# EAGLE design shield (EAGLE 9.6.2)
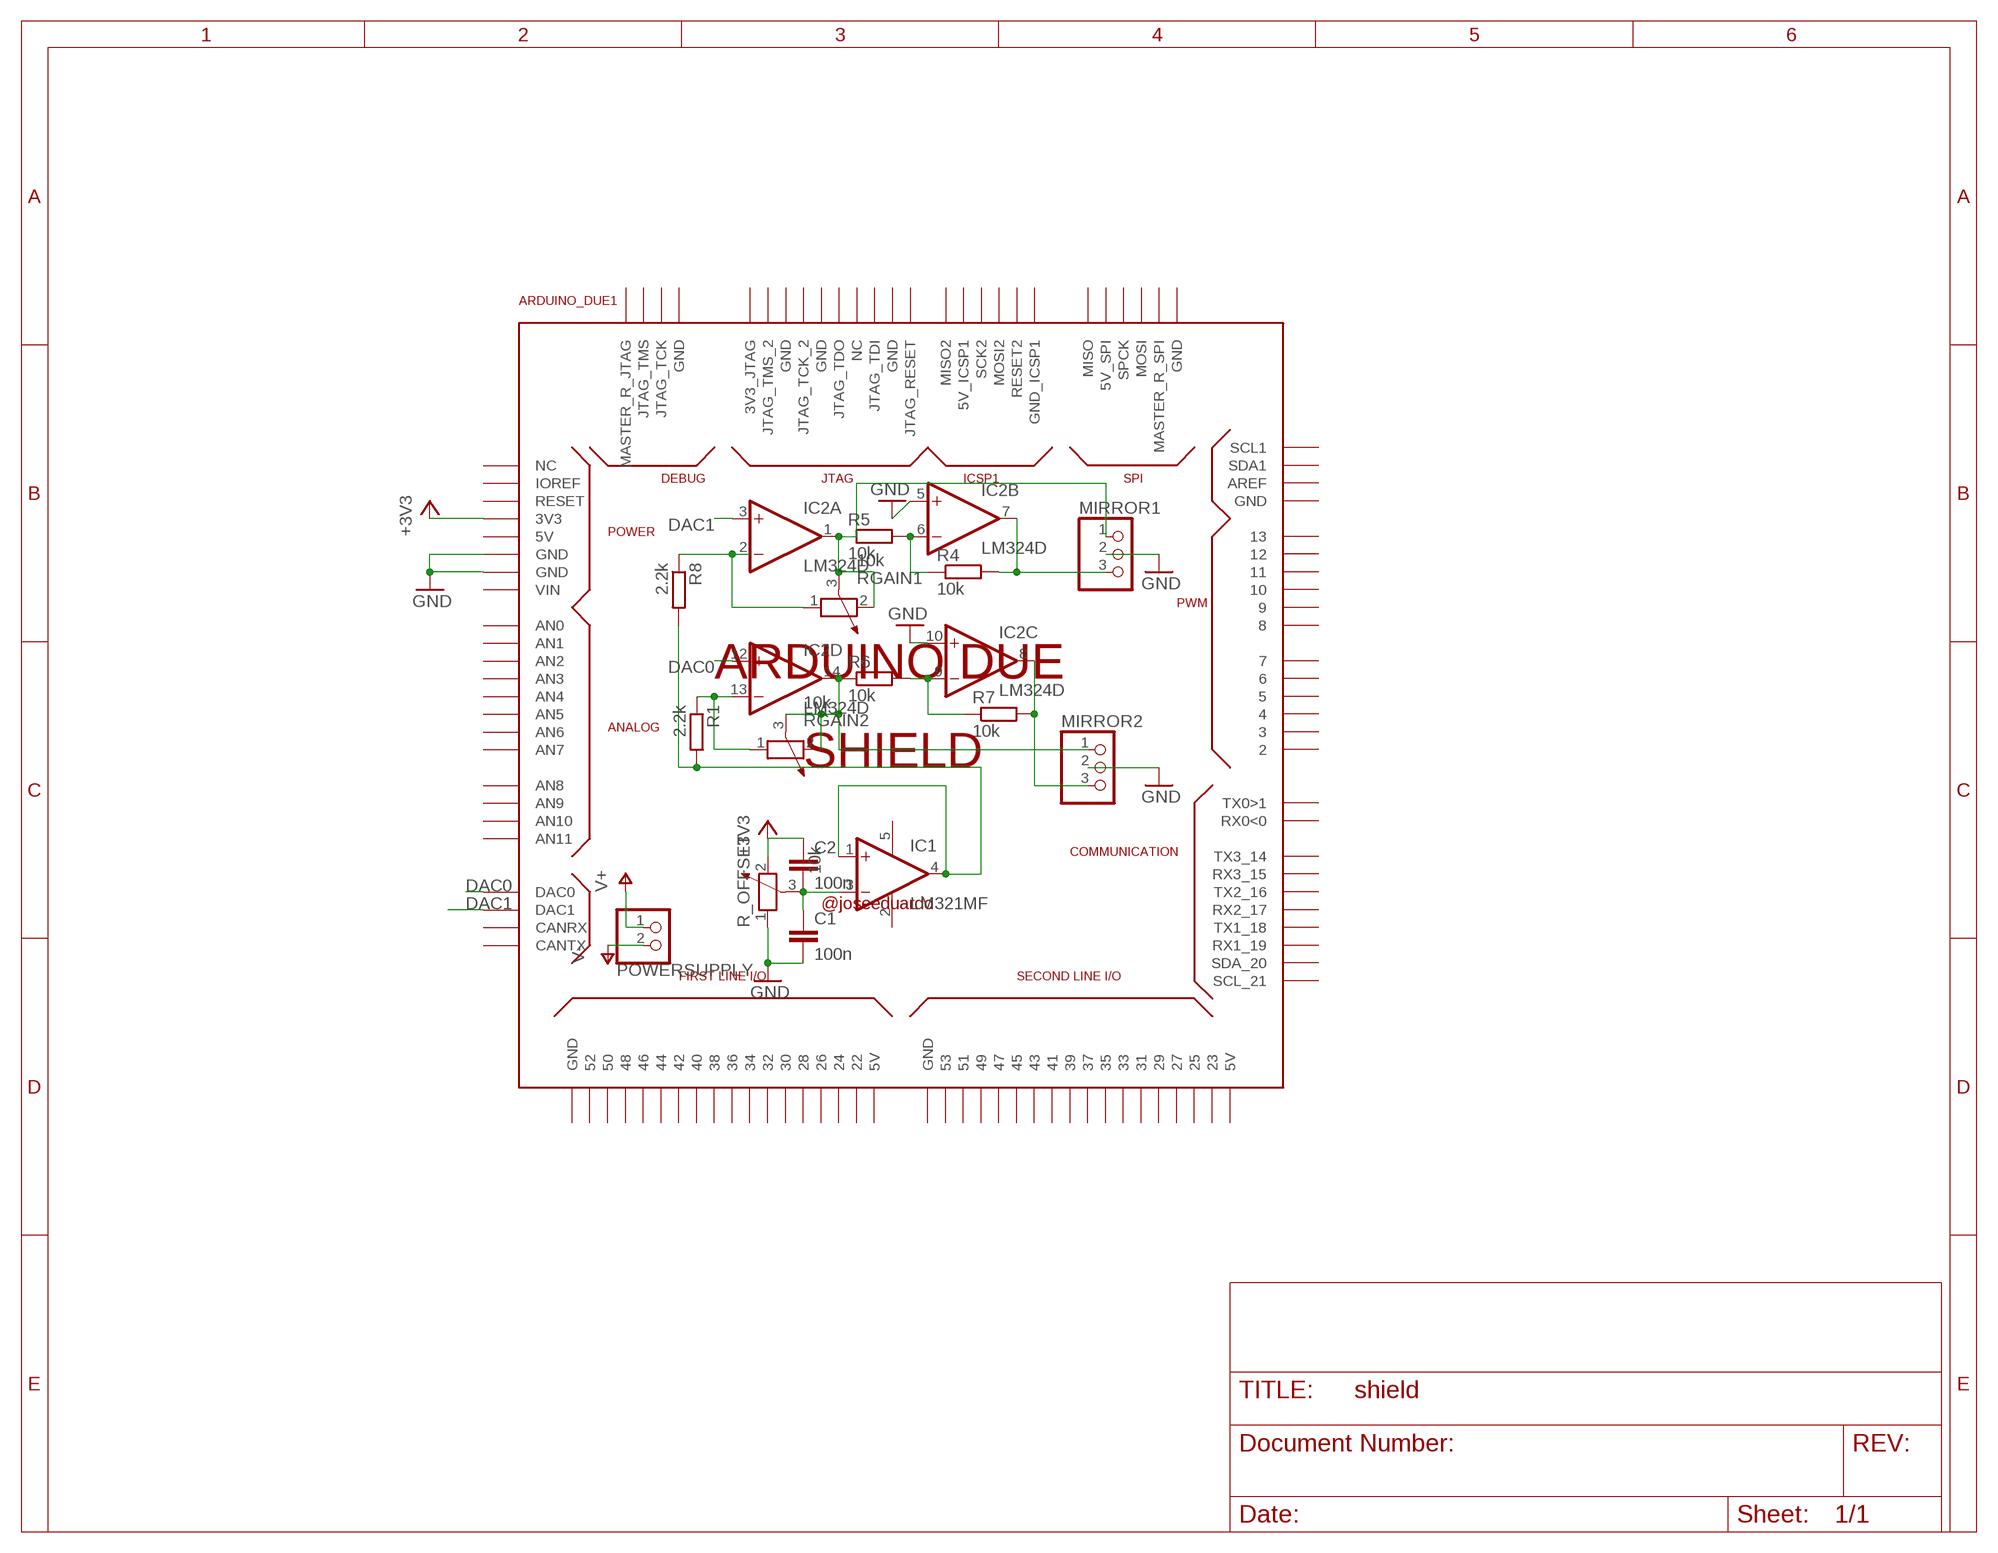
[diagram p0: schematic, sheet 1]

## Parts
ARDUINO_DUE1  ARDUINO_DUE_SHIELD  [ARDUINO_DUE_SHIELD]
C1  100n  C-EUC0201  [C0201]
C2  100n  C-EUC0201  [C0201]
IC1  LM321MF  [SOT23-5]
IC2  LM324D  [SO14]
MIRROR1  PINHD-1X3  [1X03]
MIRROR2  PINHD-1X3  [1X03]
POWERSUPPLY  PINHD-1X2  [1X02]
R1  2.2k  R-EU_0207/10  [0207/10]
R4  10k  R-EU_0207/10  [0207/10]
R5  10k  R-EU_0207/10  [0207/10]
R6  10k  R-EU_0207/10  [0207/10]
R7  10k  R-EU_0207/10  [0207/10]
R8  2.2k  R-EU_0207/10  [0207/10]
R_OFFSET  10k  POTENTIOMETER_PT-10  [PT-10]
RGAIN1  10k  POTENTIOMETER_PT-10  [PT-10]
RGAIN2  10k  POTENTIOMETER_PT-10  [PT-10]

## Nets
+3V3: ARDUINO_DUE1.3V3 C2.1 R_OFFSET.2
DAC0: ARDUINO_DUE1.DAC0 IC2.12(D:+IN)
DAC1: ARDUINO_DUE1.DAC1 IC2.3(A:+IN)
GND: ARDUINO_DUE1.GND ARDUINO_DUE1.GND_1(GND) C1.2 IC2.5(B:+IN) IC2.10(C:+IN) MIRROR1.2 MIRROR2.2 R_OFFSET.1
N$1: IC2.6(B:-IN) R4.1 R5.2
N$2: IC1.1(+IN) IC1.4(OUT) R1.2 R8.2
N$3: IC2.9(C:-IN) R6.2 R7.1
N$6: IC2.1(A:OUT) MIRROR1.1 R5.1 RGAIN1.2 RGAIN1.3
N$7: IC2.2(A:-IN) R8.1 RGAIN1.1
N$8: IC2.14(D:OUT) MIRROR2.1 R6.1 RGAIN2.2 RGAIN2.3
N$9: IC2.8(C:OUT) MIRROR2.3 R7.2
N$10: IC2.13(D:-IN) R1.1 RGAIN2.1
N$11: IC2.7(B:OUT) MIRROR1.3 R4.2
N$14: C1.1 C2.2 IC1.3(-IN) R_OFFSET.3
V+: POWERSUPPLY.1
V-: POWERSUPPLY.2
Unconnected: ARDUINO_DUE1.0(RX0<0) ARDUINO_DUE1.1(TX0>1) ARDUINO_DUE1.2 ARDUINO_DUE1.3 ARDUINO_DUE1.3V3_JTAG ARDUINO_DUE1.4 ARDUINO_DUE1.5 ARDUINO_DUE1.5V0(5V) ARDUINO_DUE1.5V0_1(5V) ARDUINO_DUE1.5V0_2(5V) ARDUINO_DUE1.5V_2(5V_SPI) ARDUINO_DUE1.5V_ICSP1 ARDUINO_DUE1.6 ARDUINO_DUE1.7 ARDUINO_DUE1.8 ARDUINO_DUE1.9 ARDUINO_DUE1.10 ARDUINO_DUE1.11 ARDUINO_DUE1.12 ARDUINO_DUE1.13 ARDUINO_DUE1.14(TX3_14) ARDUINO_DUE1.15(RX3_15) ARDUINO_DUE1.16(TX2_16) ARDUINO_DUE1.17(RX2_17) ARDUINO_DUE1.18(TX1_18) ARDUINO_DUE1.19(RX1_19) ARDUINO_DUE1.20(SDA_20) ARDUINO_DUE1.21(SCL_21) ARDUINO_DUE1.22 ARDUINO_DUE1.23 ARDUINO_DUE1.24 ARDUINO_DUE1.25 ARDUINO_DUE1.26 ARDUINO_DUE1.27 ARDUINO_DUE1.28 ARDUINO_DUE1.29 ARDUINO_DUE1.30 ARDUINO_DUE1.31 ARDUINO_DUE1.32 ARDUINO_DUE1.33 ARDUINO_DUE1.34 ARDUINO_DUE1.35 ARDUINO_DUE1.36 ARDUINO_DUE1.37 ARDUINO_DUE1.38 ARDUINO_DUE1.39 ARDUINO_DUE1.40 ARDUINO_DUE1.41 ARDUINO_DUE1.42 ARDUINO_DUE1.43 ARDUINO_DUE1.44 ARDUINO_DUE1.45 ARDUINO_DUE1.46 ARDUINO_DUE1.47 ARDUINO_DUE1.48 ARDUINO_DUE1.49 ARDUINO_DUE1.50 ARDUINO_DUE1.51 ARDUINO_DUE1.52 ARDUINO_DUE1.53 ARDUINO_DUE1.A0(AN0) ARDUINO_DUE1.A1(AN1) ARDUINO_DUE1.A2(AN2) ARDUINO_DUE1.A3(AN3) ARDUINO_DUE1.A4(AN4) ARDUINO_DUE1.A5(AN5) ARDUINO_DUE1.A6(AN6) ARDUINO_DUE1.A7(AN7) ARDUINO_DUE1.A8(AN8) ARDUINO_DUE1.A9(AN9) ARDUINO_DUE1.A10(AN10) ARDUINO_DUE1.A11(AN11) ARDUINO_DUE1.AREF ARDUINO_DUE1.CANRX ARDUINO_DUE1.CANTX ARDUINO_DUE1.GND_2(GND) ARDUINO_DUE1.GND_3(GND) ARDUINO_DUE1.GND_4(GND) ARDUINO_DUE1.GND_5(GND) ARDUINO_DUE1.GND_7(GND) ARDUINO_DUE1.GND_8(GND) ARDUINO_DUE1.GND_9(GND) ARDUINO_DUE1.GND_10(GND) ARDUINO_DUE1.GND_ICSP1 ARDUINO_DUE1.IOREF ARDUINO_DUE1.JTAG_RESET ARDUINO_DUE1.JTAG_TCK ARDUINO_DUE1.JTAG_TCK_2 ARDUINO_DUE1.JTAG_TDI ARDUINO_DUE1.JTAG_TDO ARDUINO_DUE1.JTAG_TMS ARDUINO_DUE1.JTAG_TMS_2 ARDUINO_DUE1.MASTER_RESET_JTAG(MASTER_R_JTAG) ARDUINO_DUE1.MASTER_RESET_SPI(MASTER_R_SPI) ARDUINO_DUE1.MISO ARDUINO_DUE1.MISO2 ARDUINO_DUE1.MOSI ARDUINO_DUE1.MOSI2 ARDUINO_DUE1.NC_2(NC) ARDUINO_DUE1.NC_5(NC) ARDUINO_DUE1.RESET ARDUINO_DUE1.RESET2 ARDUINO_DUE1.SCK2 ARDUINO_DUE1.SCL1 ARDUINO_DUE1.SDA1 ARDUINO_DUE1.SPCK ARDUINO_DUE1.VIN

## Power pins joined to a net without a drawn wire
V+: IC1.5(V+) IC2.4(P:V+)
V-: IC1.2(V-) IC2.11(P:V-)

## Library data of the parts
ARDUINO_DUE1 = arduino_due_shield:ARDUINO_DUE_SHIELD
C1 C2 = rcl:C-EU: CAPACITOR, European symbol; SPICEPREFIX: C
IC1 = linear:LM321?*: Low Power Single Op Amp Source: http://cache.national.com/ds/LM/LM321.pdf
IC2 = linear:LM324: OP AMP
MIRROR1 MIRROR2 = pinhead:PINHD-1X3: PIN HEADER
POWERSUPPLY = pinhead:PINHD-1X2: PIN HEADER
R1 R4-R8 = rcl:R-EU_: RESISTOR, European symbol; SPICEPREFIX: R
R_OFFSET RGAIN1 RGAIN2 = rcl:POTENTIOMETER_: Potentiometer; SPICEMODEL: POT; SPICEPREFIX: X

## Board
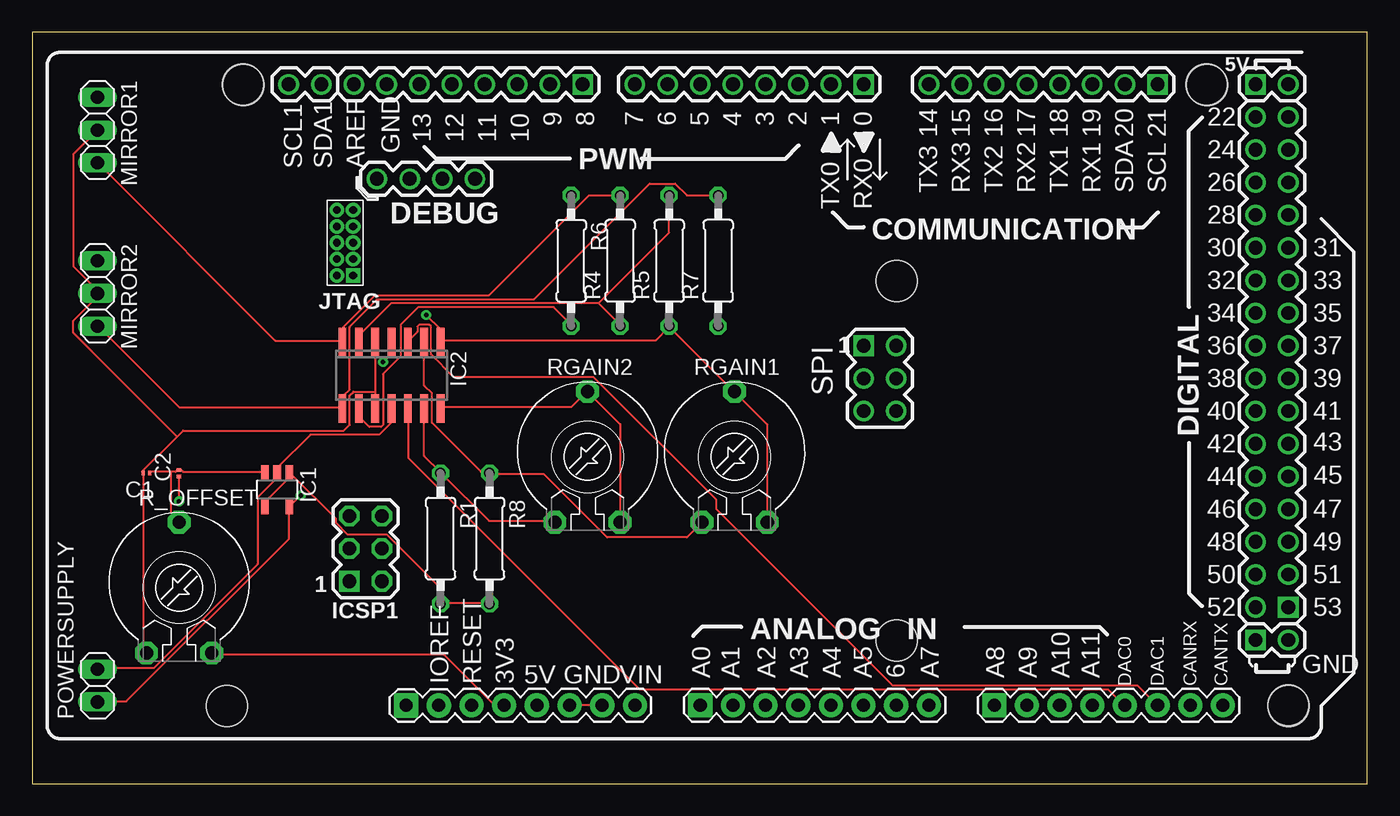
[diagram p1: board, top side]
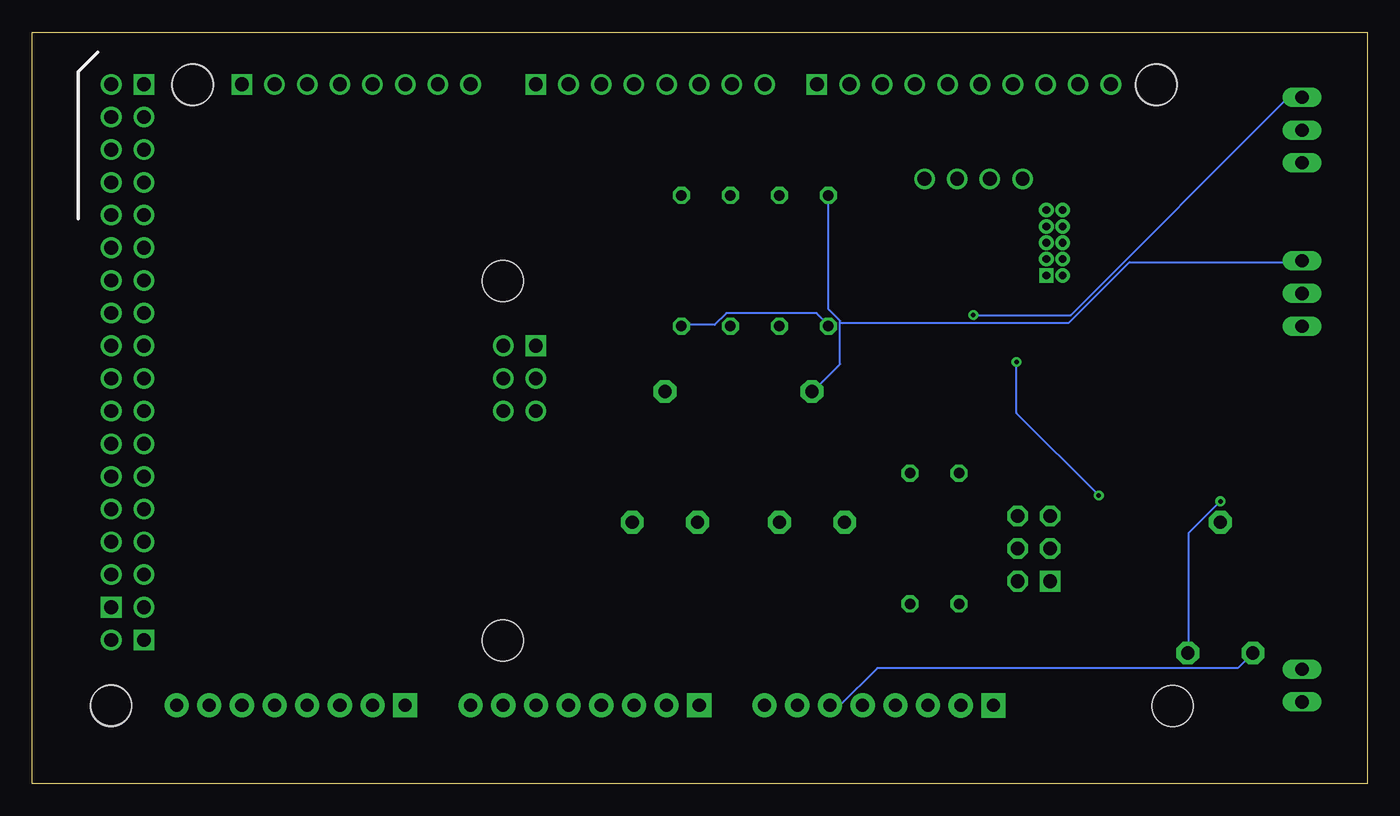
[diagram p2: board, bottom side, seen from below]

Size 103.81 x 58.41 mm. Coordinates in mm from the lower left corner, seen from the top.
Outline: 0,0 103.81,0 103.81,58.41 0,58.41 0,0
Copper layers (1*16): Top 0.035mm / dielectric 1.5mm / Bottom 0.035mm
Design rules "default": minimum track width 6mil, minimum drill 0.35mm, track to track 6mil, track to pad 6mil, pad to pad 6mil, via to via 6mil, smd to smd 6mil, copper to edge 40mil, drill to drill 6mil, minimum pad ring 10mil, minimum via ring 8mil, stop-mask expansion 4mil, vias tented up to drill 0mil, thermal gap 10mil

### Footprints (pad centres in the part's own frame; a part is rotated, then mirrored left to right if it is on the bottom)
ARDUINO_DUE_SHIELD = drill 1.067 square: 0 63.373,51.816; 5V0_1 93.853,51.816; 8 41.529,51.816; 21 86.233,51.816; 53 96.393,11.176; GND_2 93.853,8.636; MISO 63.373,31.496; MISO2 23.384,13.196 | drill 1.067: 1 60.833,51.816; 2 58.293,51.816; 3 55.753,51.816; 4 53.213,51.816; 5 50.673,51.816; 5V0_2 96.393,51.816; 5V_2 65.913,31.496; 6 48.133,51.816; 7 45.593,51.816; 9 38.989,51.816; 10 36.449,51.816; 11 33.909,51.816; 12 31.369,51.816; 13 28.829,51.816; 14 68.453,51.816; 15 70.993,51.816; 16 73.533,51.816; 17 76.073,51.816; 18 78.613,51.816; 19 81.153,51.816; 20 83.693,51.816; 22 93.853,49.276; 23 96.393,49.276; 24 93.853,46.736; 25 96.393,46.736; 26 93.853,44.196; 27 96.393,44.196; 28 93.853,41.656; 29 96.393,41.656; 30 93.853,39.116; 31 96.393,39.116; 32 93.853,36.576; 33 96.393,36.576; 34 93.853,34.036; 35 96.393,34.036; 36 93.853,31.496; 37 96.393,31.496; 38 93.853,28.956; 39 96.393,28.956; 40 93.853,26.416; 41 96.393,26.416; 42 93.853,23.876; 43 96.393,23.876; 44 93.853,21.336; 45 96.393,21.336; 46 93.853,18.796; 47 96.393,18.796; 48 93.853,16.256; 49 96.393,16.256; 50 93.853,13.716; 51 96.393,13.716; 52 93.853,11.176; AREF 23.749,51.816; GND_3 96.393,8.636; GND_4 26.289,51.816; GND_5 65.913,26.416; GND_7 33.161,44.473; JTAG_TCK 30.621,44.473; JTAG_TMS 28.081,44.473; MASTER_RESET_JTAG 25.541,44.473; MASTER_RESET_SPI 63.373,26.416; MOSI 65.913,28.956; SCL1 18.669,51.816; SDA1 21.209,51.816; SPCK 63.373,28.956 | drill 1.016 pad 1.88: 3V3 35.433,3.556; 5V0 37.973,3.556; A1 53.213,3.556; A2 55.753,3.556; A3 58.293,3.556; A4 60.833,3.556; A5 63.373,3.556; A6 65.913,3.556; A7 68.453,3.556; A9 76.073,3.556; A10 78.613,3.556; A11 81.153,3.556; CANRX 88.773,3.556; CANTX 91.313,3.556; DAC0 83.693,3.556; DAC1 86.233,3.556; GND 40.513,3.556; GND_1 43.053,3.556; IOREF 30.346,3.543; RESET 32.893,3.555; VIN 45.593,3.556 | drill 0.6 pad 1.016 square: 3V3_JTAG 23.689,36.964 | drill 1.067 octagon: 5V_ICSP1 25.924,13.196; GND_ICSP1 25.924,18.276; MOSI2 25.924,15.736; RESET2 23.384,18.276; SCK2 23.384,15.736 | drill 1.016 pad 1.88 square: A0 50.673,3.556; A8 73.533,3.556; NC_2 27.806,3.543 | drill 0.6 pad 1.143: GND_8 23.689,38.234; GND_9 23.689,40.774; GND_10 23.689,42.044; JTAG_RESET 22.419,42.044; JTAG_TCK_2 22.419,38.234; JTAG_TDI 22.419,40.774; JTAG_TDO 22.419,39.504; JTAG_TMS_2 22.419,36.964; NC_5 23.689,39.504 | hole 3.2: 15.113,51.816; 90.043,51.816; 96.393,3.556; 96.418,3.505; 15.138,51.765; 90.068,51.765; 13.868,3.505; 65.938,36.525; 65.938,8.585
C0201 = smd 0.25 x 0.35: 1 -0.25,0; 2 0.25,0
SOT23-5 = smd 0.6 x 1.2: 1 -0.95,-1.306; 2 0,-1.306; 3 0.95,-1.306; 4 0.95,1.306; 5 -0.95,1.306
SO14 = smd 0.6 x 2.2: 1 -3.81,-2.6; 2 -2.54,-2.6; 3 -1.27,-2.6; 4 0,-2.6; 5 1.27,-2.6; 6 2.54,-2.6; 7 3.81,-2.6; 8 3.81,2.6; 9 2.54,2.6; 10 1.27,2.6; 11 0,2.6; 12 -1.27,2.6; 13 -2.54,2.6; 14 -3.81,2.6
1X03 = drill 1.016 long: 1 -2.54,0; 2 0,0; 3 2.54,0
1X02 = drill 1.016 long: 1 -1.27,0; 2 1.27,0
0207/10 = drill 0.813 octagon: 1 -5.08,0; 2 5.08,0
PT-10 = drill 1.016 pad 1.778 octagon: 1 -2.54,-5.08; 2 2.54,-5.08; 3 0,5.08

### Placement (x,y rotation side)
ARDUINO_DUE1  1.27,2.54 0 top
C1  8.89,24.13 180 top
C2  11.43,24.13 90 top
IC1  19.05,22.86 180 top
IC2  27.94,31.75 180 top
MIRROR1  5.08,50.8 270 top
MIRROR2  5.08,38.1 270 top
POWERSUPPLY  5.08,7.62 90 top
R1  31.75,19.05 270 top
R4  45.72,40.64 90 top
R5  49.53,40.64 90 top
R6  41.91,40.64 270 top
R7  53.34,40.64 90 top
R8  35.56,19.05 270 top
R_OFFSET  11.43,15.24 0 top
RGAIN1  54.61,25.4 0 top
RGAIN2  43.18,25.4 0 top

### Tracks (layer width: path | path; a pad name or v marks a point on that pad's centre or on a via)
+3V3  (via drill 0.35)
  Top 0.152: v11.43,21.95 C2.1 | ARDUINO_DUE1.3V3 35.97,6.1 32,10.06 14.02,10.06 R_OFFSET.2
  Bottom 0.152: v11.43,21.95 13.87,19.51 13.87,10.21 R_OFFSET.2
DAC0
  Top 0.152: IC2.12 29.26,29.11 29.26,25.3 47.24,7.32 83.67,7.32 84.89,6.1 ARDUINO_DUE1.DAC0
DAC1
  Top 0.152: IC2.3 29.26,34.44 29.95,35.13 29.95,35.55 30.09,35.68 30.88,35.68 31.01,35.55 31.01,33.37 32.78,31.6 43.64,31.6 53.19,22.05 53.19,21.34 66.91,7.62 85.95,7.62 87.48,6.1 ARDUINO_DUE1.DAC1
GND
  Top 0.152: 5.03,38.1 5.03,38.41 3.2,40.23 3.2,48.92 MIRROR1.2 | ARDUINO_DUE1.GND_1 ARDUINO_DUE1.GND | IC2.5 26.67,30.48 | 26.67,30.48 IC2.10 | R_OFFSET.1 8.69,10.36 8.69,24.08 C1.2 8.53,24.23 11.28,26.98 | 26.67,30.48 24.99,30.48 24.69,30.17 24.69,27.89 24.23,27.43 11.73,27.43 11.28,26.98 | 5.03,38.1 5.03,37.8 3.2,35.97 3.2,35.05 11.28,26.98 | 5.03,38.1 MIRROR2.2
  Bottom 0.152: ARDUINO_DUE1.GND 41,6.1 38.1,8.99 10.06,8.99 R_OFFSET.1
N$1
  Top 0.152: 44.04,37.34 27.89,37.34 25.45,34.9 25.45,34.44 IC2.6 | 44.04,37.34 45.72,35.66 R4.1 | R5.2 49.53,42.82 44.04,37.34
N$2
  Top 0.152: IC1.4 18.14,21.64 18.14,21.95 19.96,23.77 19.96,24.08 IC1.1 20.12,24.08 23.62,20.57 23.62,20.27 24.54,19.36 27.58,19.36 31.7,15.24 31.7,14.02 R1.2 31.85,14.02 35.51,14.02 R8.2
N$3
  Top 0.152: IC2.9 25.45,29.11 25.45,28.5 26.21,27.74 27.13,27.74 27.28,27.89 27.28,31.85 28.65,33.22 28.65,35.66 30.02,37.03 40.54,37.03 41.91,35.66 R6.2
  Bottom 0.152: R7.1 53.34,35.66 50.75,35.66 49.84,36.58 42.82,36.58 41.91,35.66 R6.2
N$6  (via drill 0.35)
  Top 0.152: 49.53,35.51 48.46,34.44 31.85,34.44 IC2.1 31.7,34.44 31.7,35.36 v30.63,36.42 | 49.53,35.51 54.56,30.48 RGAIN1.3 57.15,27.94 RGAIN1.2 | 49.53,35.51 R5.1
  Bottom 0.152: MIRROR1.1 6.15,53.34 23.06,36.42 v30.63,36.42
N$7
  Top 0.152: IC2.2 30.48,30.94 31.09,30.33 31.09,28.04 34.9,24.23 35.51,24.23 R8.1 35.66,24.08 39.78,24.08 44.7,19.15 50.9,19.15 RGAIN1.1
N$8
  Top 0.152: IC2.14 31.85,29.26 41.91,29.26 43.13,30.48 RGAIN2.3 45.72,27.94 RGAIN2.2
  Bottom 0.152: R6.1 41.91,36.88 41,35.97 41,35.81 | 41,35.81 41,32.61 43.13,30.48 RGAIN2.3 | 41,35.81 23.22,35.81 18.49,40.54 5.18,40.54 MIRROR2.1
N$9
  Top 0.152: MIRROR2.3 5.18,35.51 11.43,29.26 24.08,29.26 IC2.8 24.23,29.26 24.23,30.17 24.69,30.63 24.69,35.51 26.82,37.64 39.01,37.64 48.01,46.63 49.99,46.63 50.9,45.72 R7.2
N$10
  Top 0.152: IC2.13 30.48,25.45 31.7,24.23 R1.1 31.85,24.08 35.51,20.42 40.54,20.42 RGAIN2.1
N$11
  Top 0.152: MIRROR1.3 18.9,34.44 24.08,34.44 IC2.7 24.23,34.44 24.23,35.51 26.67,37.95 35.51,37.95 43.28,45.72 R4.2
N$14
  Top 0.152: 10.82,24.23 11.12,24.23 11.28,24.38 C2.2 | 10.82,24.23 9.14,24.23 C1.1 | 10.82,24.23 10.82,21.03 11.43,20.42 R_OFFSET.3 | C2.2 11.58,24.38 11.73,24.23 17.98,24.23 IC1.3 | C2.2
V+  (via drill 0.35)
  Top 0.152: POWERSUPPLY.1 5.18,6.4 7.32,6.4 19.96,19.05 19.96,21.49 IC1.5 20.12,21.64 v20.88,22.4 | v27.28,32.77 27.89,33.38 27.89,34.29 IC2.4
  Bottom 0.152: v27.28,32.77 27.28,28.8 v20.88,22.4
V-
  Top 0.152: IC2.11 27.89,29.11 27.89,28.04 26.98,27.13 21.64,27.13 19.05,24.54 IC1.2 19.05,23.77 17.53,22.25 17.53,17.07 9.45,8.99 5.18,8.99 POWERSUPPLY.2